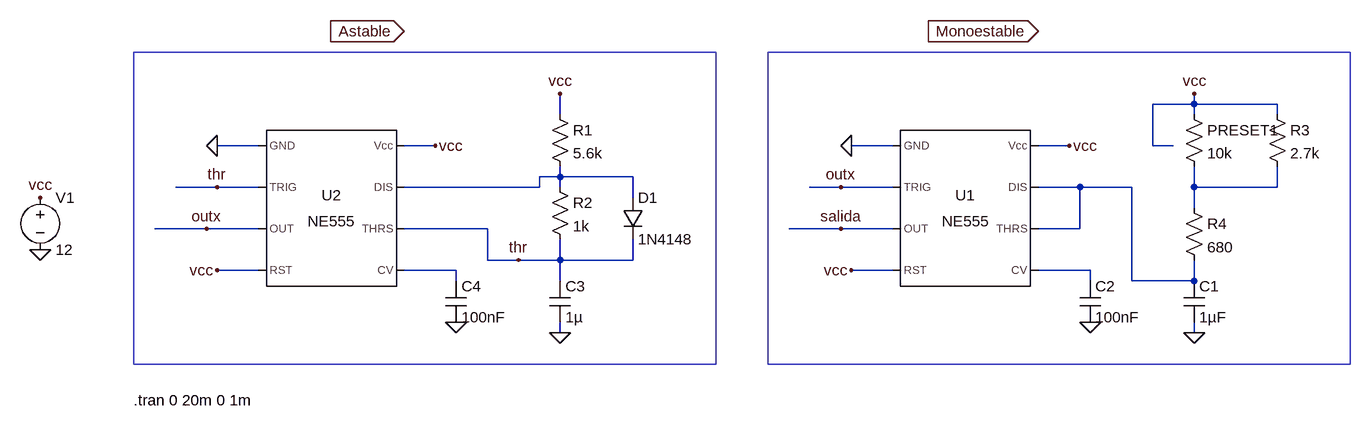
[diagram p0: schematic pwm funcionsl.asc]
pwm funcionsl.asc, the LTspice schematic file:
Version 4
SHEET 1 880 680
WIRE 304 32 304 16
WIRE 304 32 240 32
WIRE 432 32 304 32
WIRE -672 48 -672 16
WIRE 304 48 304 32
WIRE 432 48 432 32
WIRE -1136 96 -1200 96
WIRE -864 96 -912 96
WIRE -160 96 -224 96
WIRE 112 96 64 96
WIRE 240 96 240 32
WIRE 272 96 240 96
WIRE -672 144 -672 128
WIRE -672 144 -704 144
WIRE -560 144 -672 144
WIRE -1200 160 -1264 160
WIRE -1136 160 -1200 160
WIRE -704 160 -704 144
WIRE -704 160 -912 160
WIRE -672 160 -672 144
WIRE -240 160 -288 160
WIRE -160 160 -240 160
WIRE 128 160 64 160
WIRE 208 160 128 160
WIRE 304 160 304 128
WIRE 432 160 432 128
WIRE 432 160 304 160
WIRE -560 176 -560 144
WIRE 304 192 304 160
WIRE -1216 224 -1296 224
WIRE -1136 224 -1216 224
WIRE -784 224 -912 224
WIRE -240 224 -320 224
WIRE -160 224 -240 224
WIRE 128 224 128 160
WIRE 128 224 64 224
WIRE -784 272 -784 224
WIRE -736 272 -784 272
WIRE -672 272 -672 240
WIRE -672 272 -736 272
WIRE -560 272 -560 240
WIRE -560 272 -672 272
WIRE -1136 288 -1200 288
WIRE -832 288 -912 288
WIRE -160 288 -224 288
WIRE 144 288 64 288
WIRE -832 304 -832 288
WIRE -672 304 -672 272
WIRE 144 304 144 288
WIRE 208 304 208 160
WIRE 304 304 304 272
WIRE 304 304 208 304
WIRE -672 384 -672 368
WIRE 304 384 304 368
FLAG 304 16 vcc
FLAG -224 96 0
FLAG 112 96 vcc
FLAG -224 288 vcc
FLAG 144 368 0
FLAG 64 -80 Monoestable
IOPIN 64 -80 In
FLAG -672 16 vcc
FLAG -672 384 0
FLAG -1200 96 0
FLAG -864 96 vcc
FLAG -1200 288 vcc
FLAG -832 368 0
FLAG -1216 224 outx
FLAG -912 -80 Astable
IOPIN -912 -80 In
FLAG -736 272 thr
FLAG -1200 160 thr
FLAG -240 224 salida
FLAG -1472 176 vcc
FLAG -1472 256 0
FLAG 304 384 0
FLAG -240 160 outx
SYMBOL Misc\\NE555 -48 192 R0
SYMATTR InstName U1
SYMBOL res 288 32 R0
SYMATTR InstName PRESET1
SYMATTR Value 10k
SYMBOL res 416 32 R0
SYMATTR InstName R3
SYMATTR Value 2.7k
SYMBOL res 288 176 R0
SYMATTR InstName R4
SYMATTR Value 680
SYMBOL cap 288 304 R0
SYMATTR InstName C1
SYMATTR Value 1µF
SYMBOL cap 128 304 R0
SYMATTR InstName C2
SYMATTR Value 100nF
SYMBOL Misc\\NE555 -1024 192 R0
SYMATTR InstName U2
SYMBOL res -688 144 R0
SYMATTR InstName R2
SYMATTR Value 1k
SYMBOL cap -688 304 R0
SYMATTR InstName C3
SYMATTR Value 1µ
SYMBOL cap -848 304 R0
SYMATTR InstName C4
SYMATTR Value 100nF
SYMBOL res -688 32 R0
SYMATTR InstName R1
SYMATTR Value 5.6k
SYMBOL voltage -1472 160 R0
SYMATTR InstName V1
SYMATTR Value 12
SYMBOL diode -576 176 R0
SYMATTR InstName D1
SYMATTR Value 1N4148
TEXT -1328 488 Left 2 !.tran 0 20m 0 1m
RECTANGLE Normal 544 432 -352 -48
RECTANGLE Normal -432 432 -1328 -48

The netlist it stands for:
* pwm funcionsl.asc
XU1 0 outx salida vcc N005 N002 N002 vcc NE555  ; pins GND TRIG OUT RST CV THRS DIS Vcc
R§PRESET1 vcc N003 10k
R3 vcc N003 2.7k
R4 N003 N002 680
C1 N002 0 1µF
C2 N005 0 100nF
XU2 0 thr outx vcc N004 thr N001 vcc NE555  ; pins GND TRIG OUT RST CV THRS DIS Vcc
R2 N001 thr 1k
C3 thr 0 1µ
C4 N004 0 100nF
R1 vcc N001 5.6k
V1 vcc 0 12
D1 N001 thr 1N4148
.model D D
.lib standard.dio
.tran 0 20m 0 1m
.lib NE555.sub
.backanno
.end